# EAGLE design ProcessorBoard (EAGLE 7.1.0)
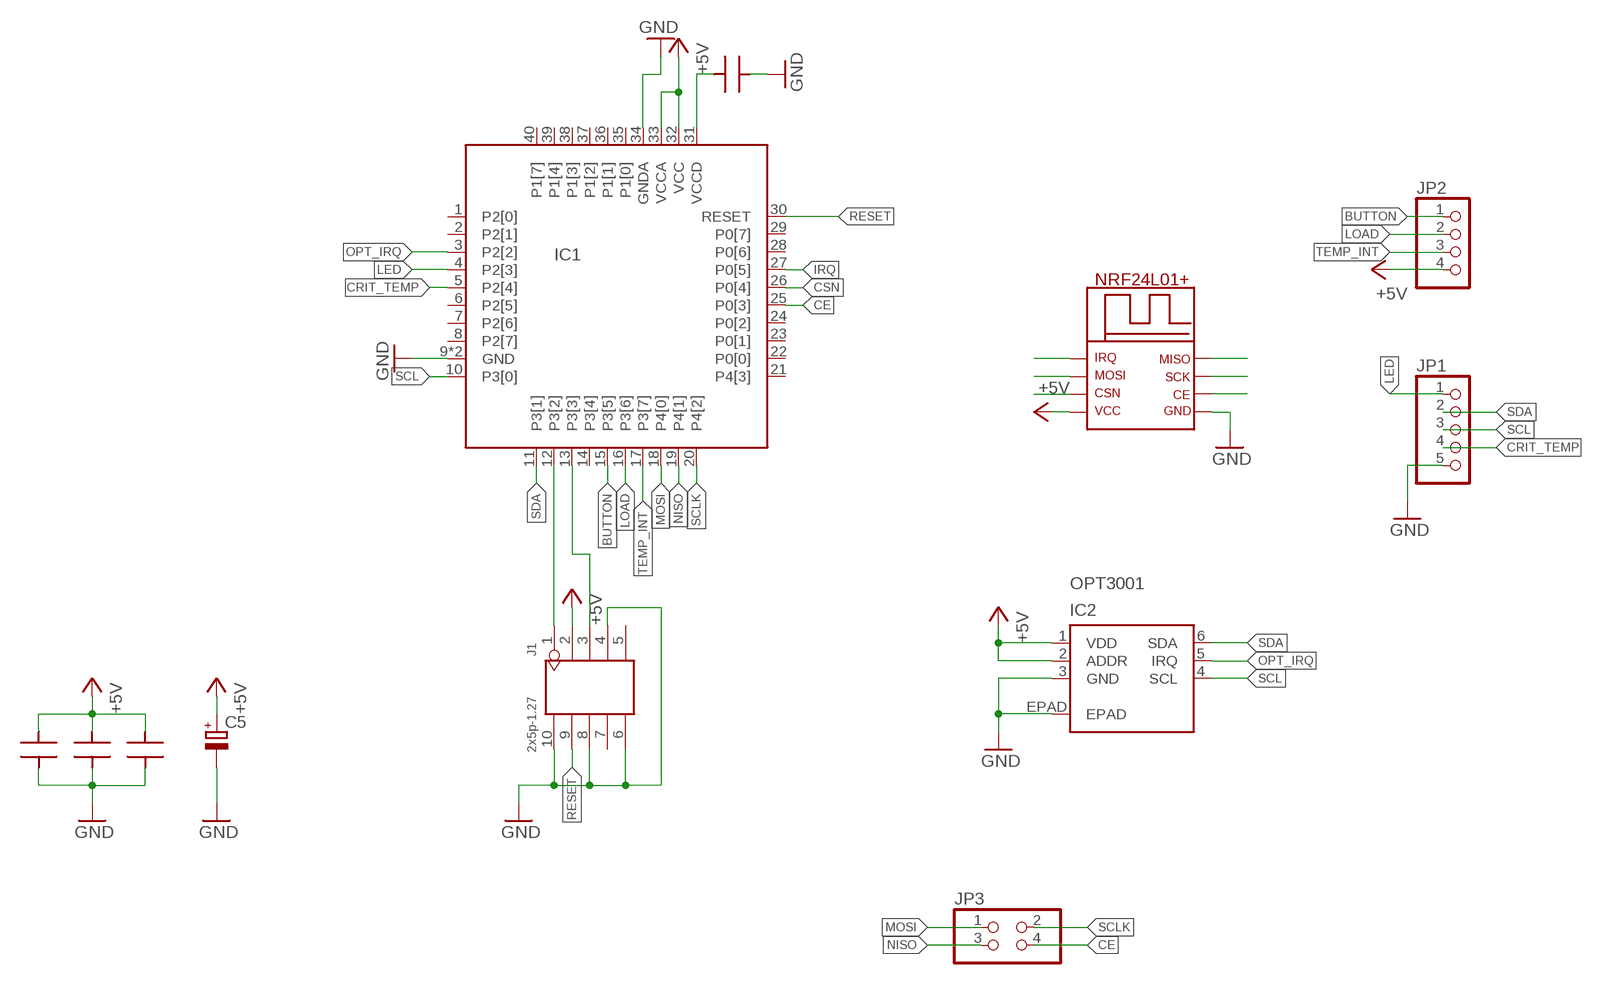
[diagram p0: schematic, sheet 1]

## Parts
C1  CAP0603  [C0603]
C2  CAP0603  [C0603]
C3  CAP0603  [C0603]
C4  CAP0603  [C0603]
C5  CPOL-EUSMCA  [SMC_A]
IC1  CY8C4245-LQI-LONG  [QFN40-LONG]
IC2  OPT3001  [USON6]
J1  2x5p-1.27  SMD-BLACK-MALE-HEADER(2X5P-1.27)  [H2X5-SMD-1.27]
JP1  PINHD-1X5  [1X05]
JP2  PINHD-1X4  [1X04]
JP3  PINHD-2X2  [2X02]
U$1  NRF24  [NRF]

## Nets
+5V: C2.2 C3.2 C4.2 C5.+ IC1.32(VCC) IC1.33(VCCA) IC2.1(VDD) IC2.2(ADDR) J1.2 JP2.4 U$1.VCC
BUTTON: IC1.15(P3[5]) JP2.1
CE: IC1.25(P0[3]) JP3.4 U$1.CE
CRIT_TEMP: IC1.5(P2[4]) JP1.4
CSN: IC1.26(P0[4]) U$1.CSN
GND: C1.2 C2.1 C3.1 C4.1 C5.- IC1.9(GND) IC1.34(GNDA) IC1.41(GND) IC2.3(GND) IC2.EPAD J1.4 J1.6 J1.8 J1.10 JP1.5 U$1.GND
IRQ: IC1.27(P0[5]) U$1.IRQ
LED: IC1.4(P2[3]) JP1.1
LOAD: IC1.16(P3[6]) JP2.2
MOSI: IC1.18(P4[0]) JP3.1 U$1.MOSI
N$1: IC1.12(P3[2]) J1.1
N$2: C1.1 IC1.31(VCCD)
N$3: IC1.13(P3[3]) J1.3
NISO: IC1.19(P4[1]) JP3.3 U$1.MISO
OPT_IRQ: IC1.3(P2[2]) IC2.5(IRQ)
RESET: IC1.30(RESET) J1.9
SCL: IC1.10(P3[0]) IC2.4(SCL) JP1.3
SCLK: IC1.20(P4[2]) JP3.2 U$1.SCK
SDA: IC1.11(P3[1]) IC2.6(SDA) JP1.2
TEMP_INT: IC1.17(P3[7]) JP2.3
Unconnected: IC1.1(P2[0]) IC1.2(P2[1]) IC1.6(P2[5]) IC1.7(P2[6]) IC1.8(P2[7]) IC1.14(P3[4]) IC1.21(P4[3]) IC1.22(P0[0]) IC1.23(P0[1]) IC1.24(P0[2]) IC1.28(P0[6]) IC1.29(P0[7]) IC1.35(P1[0]) IC1.36(P1[1]) IC1.37(P1[2]) IC1.38(P1[3]) IC1.39(P1[4]) IC1.40(P1[7]) J1.5 J1.7

## Library data of the parts
C1-C4 = My_RLC:CAP0603: Ceramic Capasitor SMD 0603
C5 = rcl:CPOL-EU: POLARIZED CAPACITOR, European symbol
IC1 = PsoC:CY8C4245-LQI-LONG: CY8C4245-LQI edit this description Auto generated by make-symbol-device-package-bsdl.ulp Rev. 44 Source: CY8C4245-LQI.txt
IC2 = My_TI:OPT3001: OPT3001 edit this description Auto generated by make-symbol-device-package-bsdl.ulp Rev. 43 Source: OPT3001.txt
J1 = Seeed-OPL-Connector:SMD-BLACK-MALE-HEADER(2X5P-1.27): 320020119; MPN: F243-1109A0BMUB2
JP1 = pinhead:PINHD-1X5: PIN HEADER
JP2 = pinhead:PINHD-1X4: PIN HEADER
JP3 = pinhead:PINHD-2X2: PIN HEADER
U$1 = NRF24l01+:NRF24

## Board
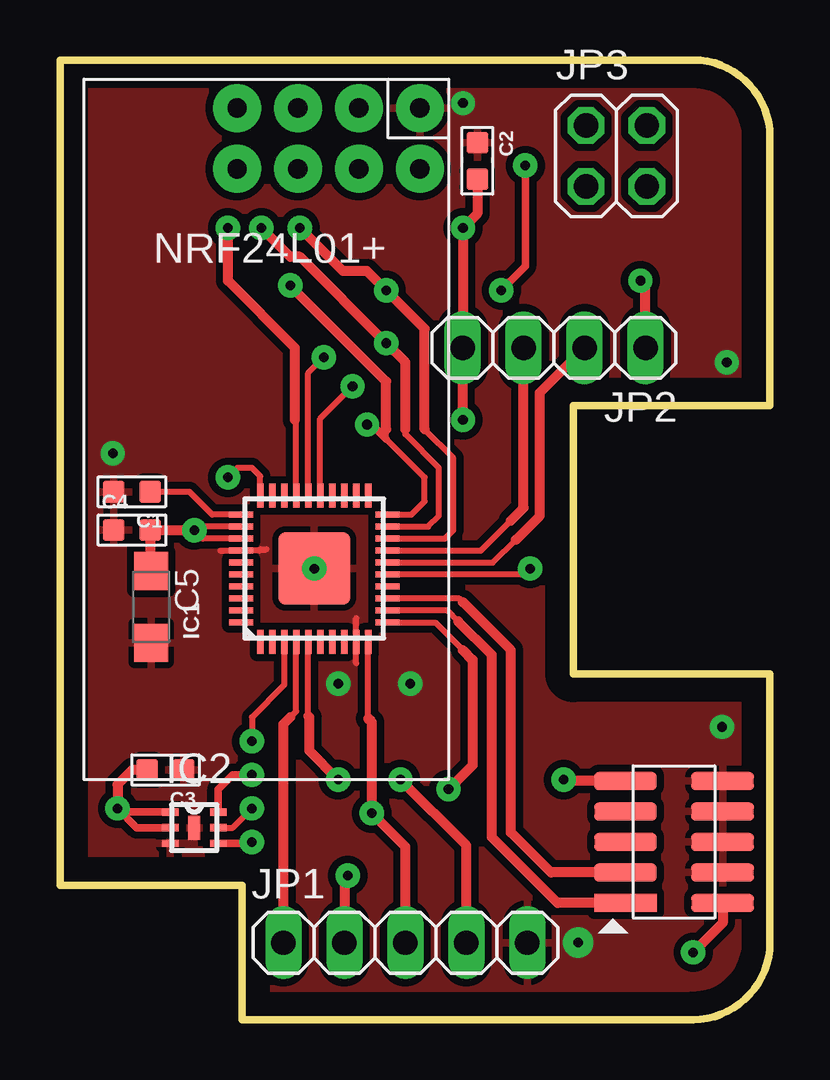
[diagram p1: board, top side]
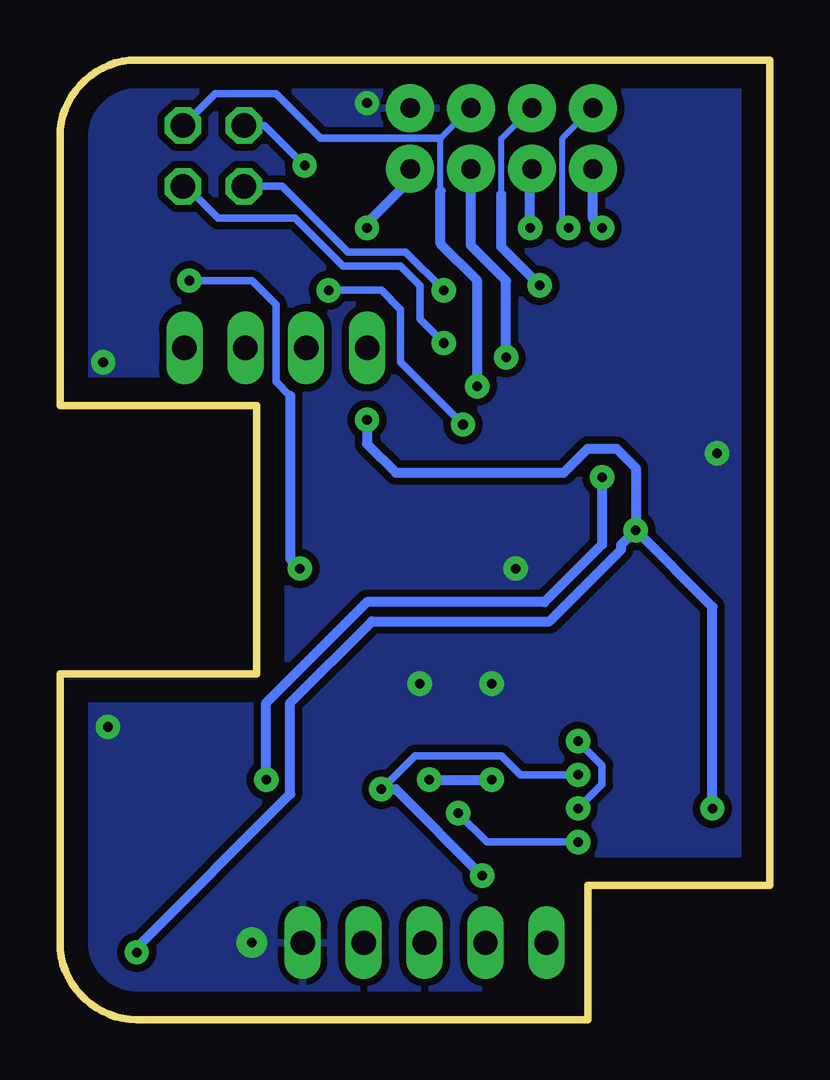
[diagram p2: board, bottom side, seen from below]

Size 29.6 x 40 mm. Coordinates in mm from the lower left corner, seen from the top.
Outline: 7.6,0 26.4,0 arc90 29.6,3.2 29.6,14.4 21.4,14.4 21.4,25.6 29.6,25.6 29.6,36.8 arc90 26.4,40 0,40 0,5.6 7.6,5.6 7.6,0
Copper layers (1*16): Top 0.035mm / dielectric 1.5mm / Bottom 0.035mm
Design rules "default": minimum track width 10mil, minimum drill 24mil, track to track 8mil, track to pad 8mil, pad to pad 8mil, via to via 8mil, smd to smd 8mil, copper to edge 40mil, drill to drill 8mil, minimum pad ring 10mil, minimum via ring 8mil, stop-mask expansion 4mil, vias tented up to drill 0mil, thermal gap 10mil

### Footprints (pad centres in the part's own frame; a part is rotated, then mirrored left to right if it is on the bottom)
C0603 = smd 0.889 x 0.889: 1 0,0.762; 2 0,-0.762
SMC_A = smd 1.6 x 1.4: + -1.5,0; - 1.5,0
QFN40-LONG = smd 1 x 0.26: 1 -3.05,2.25; 2 -3.05,1.75; 3 -3.05,1.25; 4 -3.05,0.75; 5 -3.05,0.25; 6 -3.05,-0.25; 7 -3.05,-0.75; 8 -3.05,-1.25; 9 -3.05,-1.75; 10 -3.05,-2.25; 21 3.05,-2.25; 22 3.05,-1.75; 23 3.05,-1.25; 24 3.05,-0.75; 25 3.05,-0.25; 26 3.05,0.25; 27 3.05,0.75; 28 3.05,1.25; 29 3.05,1.75; 30 3.05,2.25 | smd 0.26 x 1: 11 -2.25,-3.05; 12 -1.75,-3.05; 13 -1.25,-3.05; 14 -0.75,-3.05; 15 -0.25,-3.05; 16 0.25,-3.05; 17 0.75,-3.05; 18 1.25,-3.05; 19 1.75,-3.05; 20 2.25,-3.05; 31 2.25,3.05; 32 1.75,3.05; 33 1.25,3.05; 34 0.75,3.05; 35 0.25,3.05; 36 -0.25,3.05; 37 -0.75,3.05; 38 -1.25,3.05; 39 -1.75,3.05; 40 -2.25,3.05 | smd 3 x 3: 41 0,0
USON6 = smd 0.7 x 0.3: 1 -1,0.65; 2 -1,0; 3 -1,-0.65; 4 1,-0.65; 5 1,0; 6 1,0.65 | smd 0.5 x 1: EPAD 0,0
H2X5-SMD-1.27 = smd 0.74 x 2.6: 1 -2.54,2.025; 2 -2.54,-2.025; 3 -1.27,2.025; 4 -1.27,-2.025; 5 0,2.025; 6 0,-2.025; 7 1.27,2.025; 8 1.27,-2.025; 9 2.54,2.025; 10 2.54,-2.025
1X05 = drill 1.016 long: 1 -5.08,0; 2 -2.54,0; 3 0,0; 4 2.54,0; 5 5.08,0
1X04 = drill 1.016 long: 1 -3.81,0; 2 -1.27,0; 3 1.27,0; 4 3.81,0
2X02 = drill 1.016 octagon: 1 -1.27,-1.27; 2 -1.27,1.27; 3 1.27,-1.27; 4 1.27,1.27
NRF = drill 0.8 pad 2: CE 3.74,1.2; CSN 3.74,3.74; GND 1.2,1.2; IRQ 8.82,3.74; MISO 8.82,1.2; MOSI 6.28,3.74; SCK 6.28,1.2; VCC 1.2,3.74

### Placement (x,y rotation side)
C1  3,22 270 top
C2  17.4,35.8 0 top
C3  4.4,10.4 270 top
C4  3,20.4 90 top
C5  3.8,17.2 270 top
IC1  10.6,18.8 90 top
IC2  5.6,8 0 top
J1  25.6,7.4 90 top
JP1  14.4,3.2 0 top
JP2  20.6,28 180 top
JP3  23.2,36 0 top
U$1  16.2,39.2 180 top

### Tracks (layer width: path | path; a pad name or v marks a point on that pad's centre or on a via)
+5V  (via drill 0.4 pad 1.02)
  Top 0.254: IC1.32 5.75,20.55 v5.6,20.4 5.95,20.05 IC1.33
  Top 0.305: IC2.1 2.55,8.65 v2.4,8.8 3.2,8 IC2.2
  Top 0.406: 27.6,4.83 J1.2 27.62,4.03 v26.4,2.8 | v16.8,25 v16.79,25.01 JP2.4 v16.8,33 17.4,33.6 C2.2 | v5.6,20.4 C4.2 3.76,18.74 C5.+ | C3.2 3,10.4 2.4,9.8 v2.4,8.8
  Bottom 0.406: v2.4,8.8 2.4,17.2 v5.6,20.4 | v5.6,20.4 5.6,23 6.4,23.8 7.6,23.8 8.6,22.8 15.6,22.8 16.8,24 v16.8,25 | v26.4,2.8 26.4,3 20,9.4 20,13.2 16.6,16.6 9.2,16.6 6.2,19.6 6.2,19.8 v5.6,20.4 | U$1.VCC 15,35 16.8,33.2 v16.8,33
BUTTON  (via drill 0.4 pad 1.02)
  Top 0.254: v19.6,18.8 19.35,18.55 IC1.15
  Top 0.406: JP2.1 24.41,30.59 v24.2,30.8
  Bottom 0.305: v24.2,30.8 21.6,30.8 20.6,29.8 20.6,26.6 20,26
  Bottom 0.406: 20,26 20,19.2 v19.6,18.8
CE  (via drill 0.4 pad 1.02)
  Top 0.254: IC1.25 10.85,25.05 v12.2,26.4
  Bottom 0.254: 13.73,34.55 13.73,36.73 U$1.CE
  Bottom 0.305: 13.73,36.73 18.73,36.73 20.6,38.6 23.14,38.6 JP3.4
  Bottom 0.406: v12.2,26.4 12.2,30.8 13.73,32.33 13.73,34.55
CRIT_TEMP  (via drill 0.4 pad 1.02)
  Top 0.254: 10.35,12.65 IC1.5
  Top 0.406: JP1.4 16.94,7.26 v14.2,10 | v11.6,10 10.4,11.2 10.4,12.6 10.35,12.65
  Bottom 0.406: v14.2,10 v11.6,10
CSN  (via drill 0.4 pad 1.02)
  Top 0.254: IC1.26 10.35,26.95 v11,27.6
  Bottom 0.406: v11,27.6 11,30.8 12.46,32.26 U$1.CSN
GND  (via drill 0.4 pad 1.02, 0.4 pad 1.27)
  Top 0.254: 6.68,19.55 IC1.34 8.32,19.55 8.37,19.6 8.6,19.6 | 12.35,14.85 12.35,15.72 IC1.9 12.35,16.72
  other vias: 21.6,3.2 10.6,18.8 2.2,23.6 16.8,38.2 14.6,14 11.6,14 27.6,12.2 27.8,27.4
  pour Top (isolate 0.305): 29.6,0 29.6,40 0,40 0,0
  pour Bottom (isolate 0.305): 0,0 0,40 29.6,40 29.6,0
IRQ  (via drill 0.4 pad 1.02)
  Top 0.254: IC1.27 9.85,24.95 9.8,25
  Top 0.406: 9.8,25 9.8,28 7,30.8 v7,33
  Bottom 0.406: v7,33 7.38,33.38 U$1.IRQ
LED
  Top 0.254: 9.6,12.6 9.85,12.85 IC1.4
  Top 0.406: JP1.1 9.32,12.32 9.6,12.6
LOAD
  Top 0.254: IC1.16 18.05,19.05 19,20
  Top 0.406: 19,20 20,21 20,26.13 JP2.2
MOSI  (via drill 0.4 pad 1.02)
  Top 0.254: IC1.18 16.05,20.05 16.4,20.4 16.4,23.4 15.2,24.6
  Top 0.406: 15.2,24.6 15.2,28.8 v13.6,30.4 12.8,31.2 11.8,31.2 v10,33
  Bottom 0.305: JP3.1 20.33,34.73 17.6,32 15.2,32 v13.6,30.4
  Bottom 0.406: v10,33 10,35.38 U$1.MOSI
N$1
  Top 0.254: 16.6,16.6 16.15,17.05 IC1.12
  Top 0.406: J1.1 20.74,4.86 18,7.6 18,15.2 16.6,16.6
N$2
  Top 0.254: IC1.31 6.35,21.05 5.4,22 C1.1
N$3
  Top 0.254: 16.8,17.4 16.65,17.55 IC1.13
  Top 0.406: J1.3 20.47,6.13 18.8,7.8 18.8,15.4 16.8,17.4
NISO  (via drill 0.4 pad 1.02)
  Top 0.254: IC1.19 15.35,20.55 15.8,21 15.8,23 14.4,24.4 14.4,24.6
  Top 0.406: 14.4,24.6 14.4,27.4 v13.6,28.2 10,31.8 9.6,31.8 v8.4,33
  Bottom 0.254: U$1.MISO 8.65,36.73 8.65,33.25 v8.4,33
  Bottom 0.305: JP3.3 24.33,34.73 23,33.4 19.8,33.4 17.8,31.4 15.4,31.4 14.6,30.6 14.6,29.2 v13.6,28.2
OPT_IRQ  (via drill 0.4 pad 1.02)
  Top 0.254: IC1.3 9.35,13.95 8,12.6 v8,11.6 | IC2.5 7.2,8 v8,8.8
  Bottom 0.305: v8,8.8 7,9.8 7,10.6 v8,11.6
RESET  (via drill 0.4 pad 1.02)
  Top 0.254: IC1.30 8.35,22.65 8,23 7.4,23 v7,22.6
  Top 0.406: J1.9 21.06,9.94 v21,10
  Bottom 0.406: v7,22.6 7,19.8 9.4,17.4 16.8,17.4 21,13.2 v21,10
SCL  (via drill 0.4 pad 1.02)
  Top 0.254: 12.85,12.55 IC1.10
  Top 0.305: IC2.4 7.95,7.35 v8,7.4
  Top 0.406: JP1.3 14.4,7.2 v13,8.6 13,12.4 12.85,12.55
  Bottom 0.305: v8,7.4 11.8,7.4 v13,8.6
SCLK  (via drill 0.4 pad 1.02)
  Top 0.254: IC1.20 14.65,21.05 15.2,21.6 15.2,22.6 13.6,24.2 13.6,24.6
  Top 0.305: v19.4,35.6 19.4,31.4 v18.4,30.4 | v12.8,24.8 13,24.8 13.6,24.2
  Top 0.406: 13.6,24.6 13.6,26.6 v9.6,30.6
  Bottom 0.254: 11.2,34.4 11.2,36.72 U$1.SCK
  Bottom 0.305: JP3.2 21.07,37.27 v19.4,35.6 | v18.4,30.4 16.2,30.4 15.4,29.6 15.4,27.4 v12.8,24.8
  Bottom 0.406: v9.6,30.6 11.2,32.2 11.2,34.4
SDA  (via drill 0.4 pad 1.02)
  Top 0.254: IC1.11 15.65,16.55 16.8,15.4
  Top 0.305: IC2.6 6.6,9.6 7.2,10.2 v8,10.2
  Top 0.406: 16.8,15.4 17.2,15 17.2,10.6 v16.2,9.6 | v12,6 11.86,5.86 JP1.2
  Bottom 0.305: v8,10.2 10.4,10.2 11.2,11 14.8,11 v16.2,9.6
  Bottom 0.406: v16.2,9.6 15.6,9.6 v12,6
TEMP_INT
  Top 0.254: IC1.17 17.55,19.55 18.8,20.8
  Top 0.406: 18.8,20.8 19.33,21.33 JP2.3